# Altium schematic sheet FPGAPower&Misc.SchDoc: =ProjectName
size 420 x 297 mm; Author: G.K.; CompanyName: WUT; DrawnBy: P.K.; Organization: WUT ISE; Address1: Warsaw Univeristy of Technology; Address2: Nowowiejska 15/19; DocumentNumber: 5; Revision: 1.1; SheetNumber: 5; SheetTotal: 12; EDA_Number: ARTIQ; Projet: ARTIQ/SINARA; ModifiedBy: -; CreateDate: XX/XX/XXXX; CheckedDate: -; Title2: FPGAPower&Misc.SchDoc; DivGrp: ISE; Designer: G.K. and P.K.; ModifiedDate: -; ProjectName: ARTIQ/SINARA
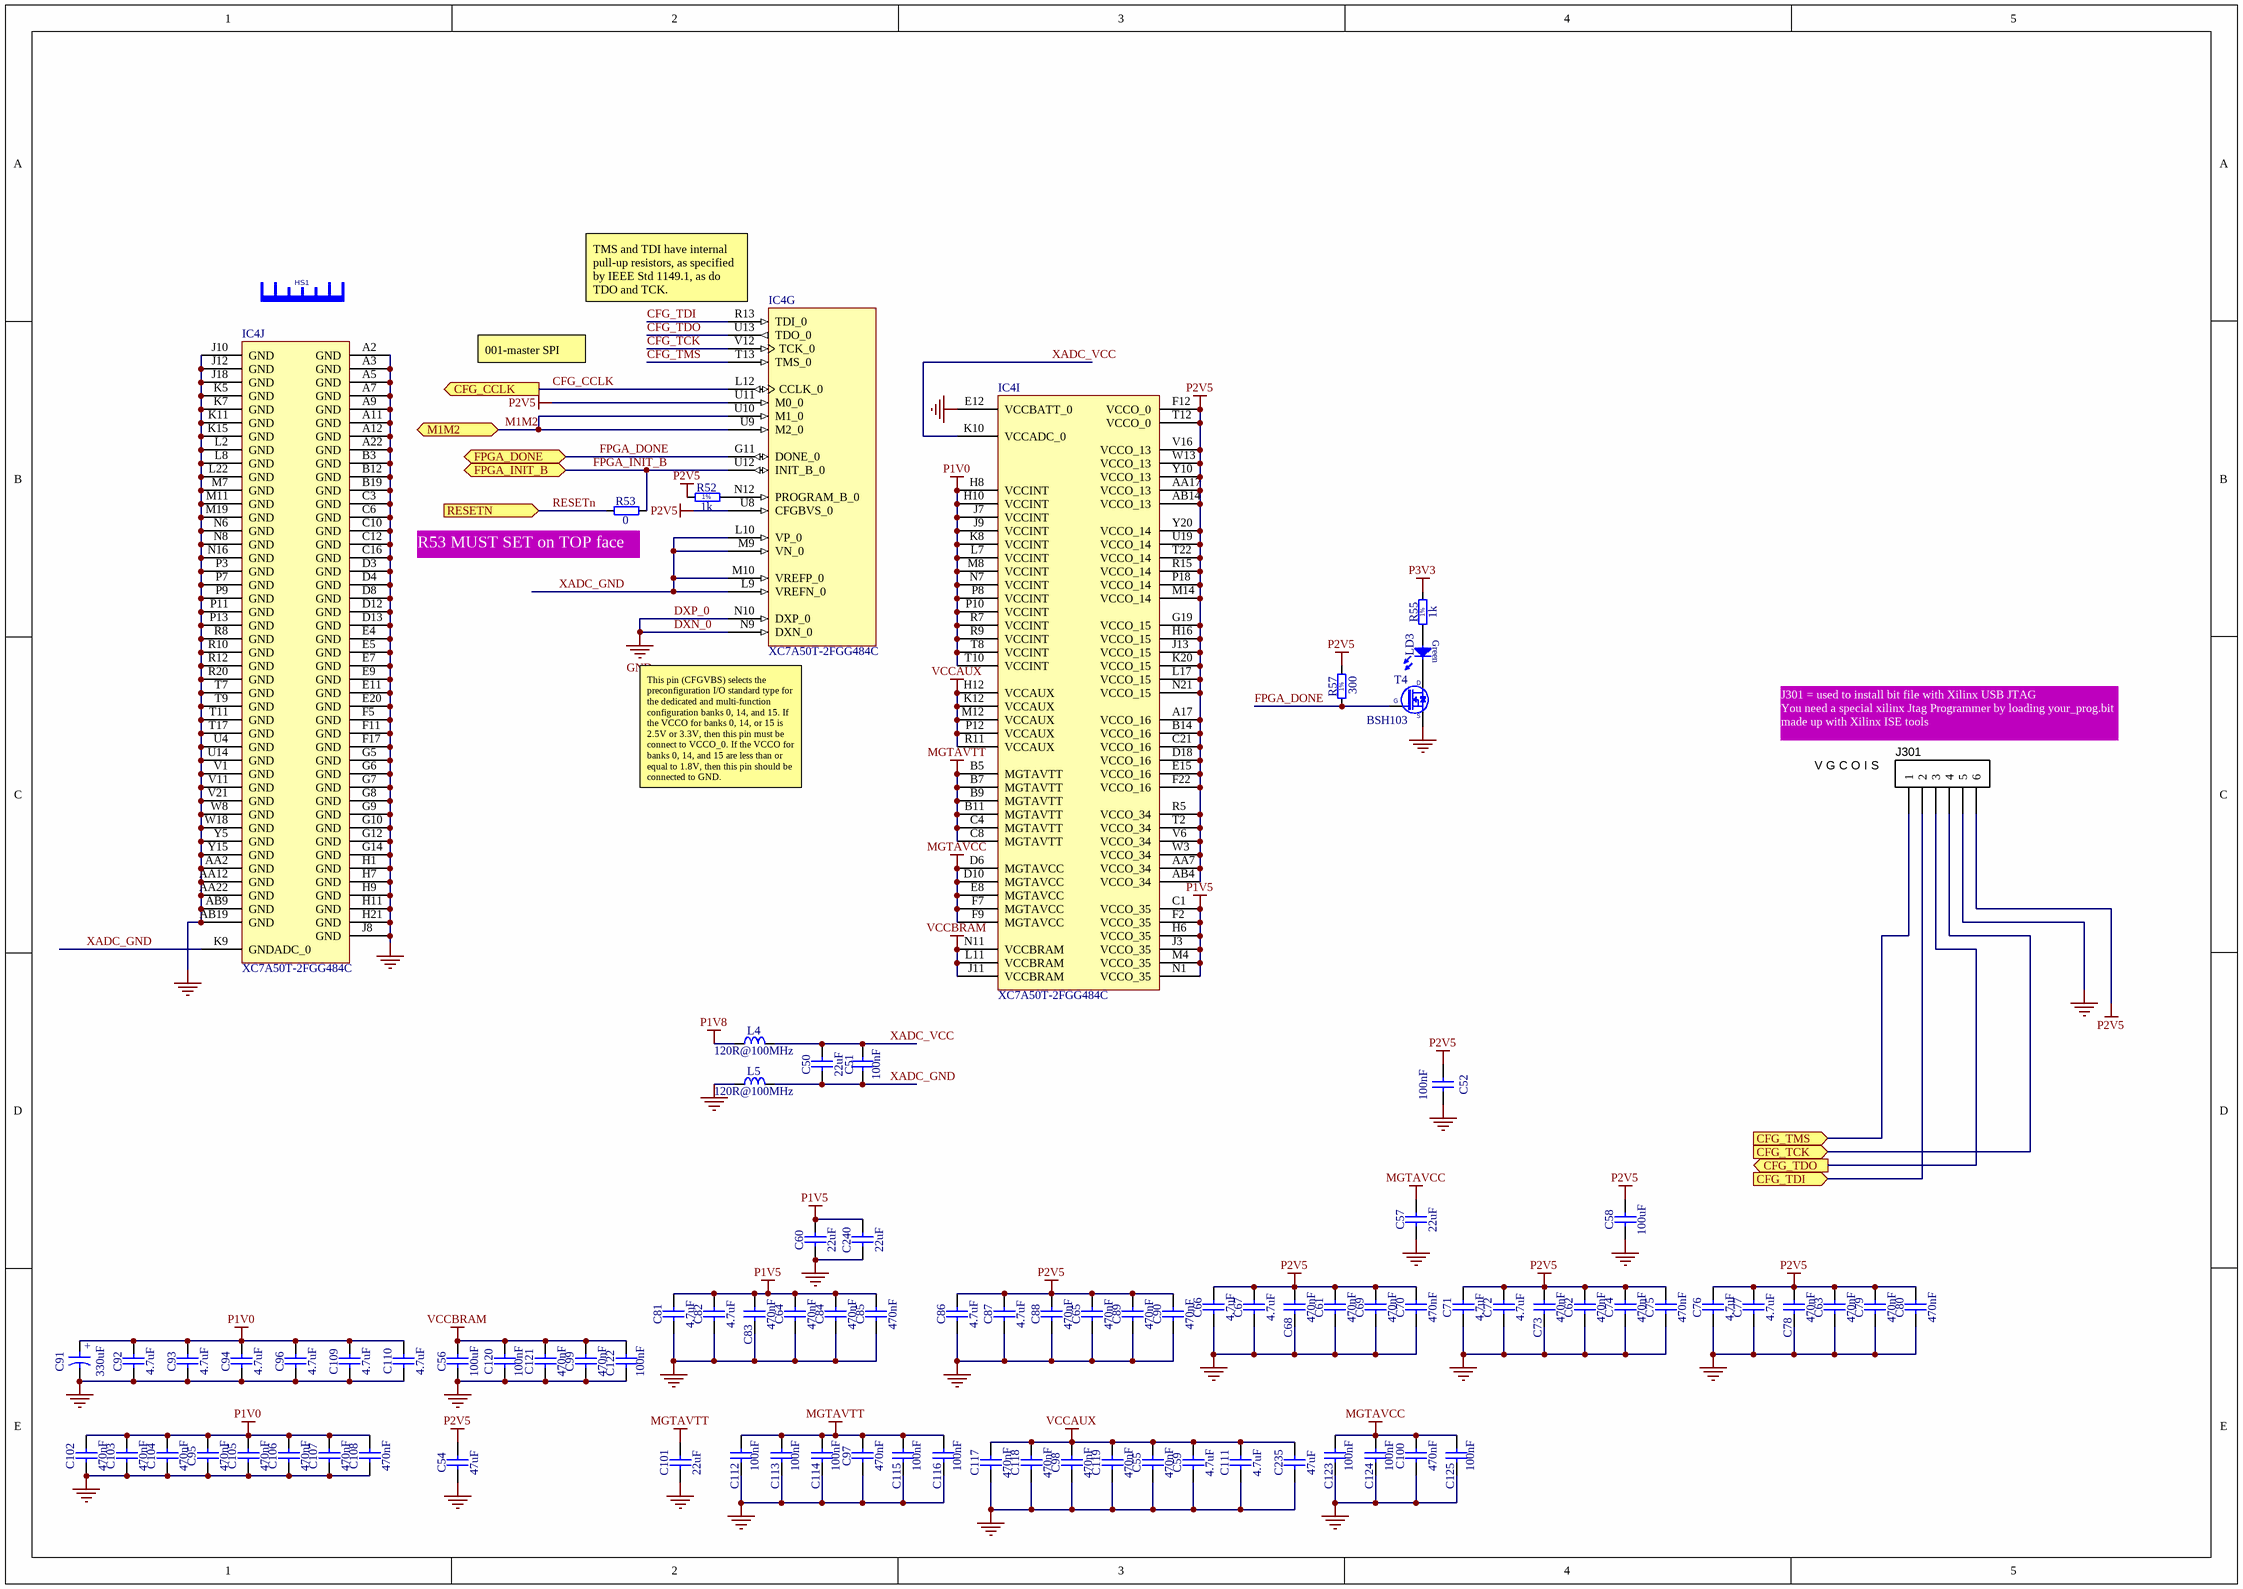
[diagram p0: FPGAPower&Misc.SchDoc]

## Parts
C50  22uF  [CAPC1709X100N]
C51  100nF  [CAPC0603X33N]
C52  100nF  [0603 Polar Cap]
C54  47uF  [CAPC3225X270N]
C55  470nF  [CAPC0603X33N]
C56  100uF  [CAPC3225X270N]
C57  22uF  [CAPC1709X100N]
C58  100uF  [CAPC3225X270N]
C59  4.7uF  [CAPC2012X135N]
C60  22uF  [CAPC1709X100N]
C61  470nF  [CAPC0603X33N]
C62  470nF  [CAPC0603X33N]
C63  470nF  [CAPC0603X33N]
C64  470nF  [CAPC0603X33N]
C65  470nF  [CAPC0603X33N]
C66  4.7uF  [CAPC2012X135N]
C67  4.7uF  [CAPC2012X135N]
C68  470nF  [CAPC0603X33N]
C69  470nF  [CAPC0603X33N]
C70  470nF  [CAPC0603X33N]
C71  4.7uF  [CAPC2012X135N]
C72  4.7uF  [CAPC2012X135N]
C73  470nF  [CAPC0603X33N]
C74  470nF  [CAPC0603X33N]
C75  470nF  [CAPC0603X33N]
C76  4.7uF  [CAPC2012X135N]
C77  4.7uF  [CAPC2012X135N]
C78  470nF  [CAPC0603X33N]
C79  470nF  [CAPC0603X33N]
C80  470nF  [CAPC0603X33N]
C81  4.7uF  [CAPC2012X135N]
C82  4.7uF  [CAPC2012X135N]
C83  470nF  [CAPC0603X33N]
C84  470nF  [CAPC0603X33N]
C85  470nF  [CAPC0603X33N]
C86  4.7uF  [CAPC2012X135N]
C87  4.7uF  [CAPC2012X135N]
C88  470nF  [CAPC0603X33N]
C89  470nF  [CAPC0603X33N]
C90  470nF  [CAPC0603X33N]
C91  330uF  [CAPMP7343X190N]
C92  4.7uF  [CAPC2012X135N]
C93  4.7uF  [CAPC2012X135N]
C94  4.7uF  [CAPC2012X135N]
C95  470nF  [CAPC0603X33N]
C96  4.7uF  [CAPC2012X135N]
C97  470nF  [CAPC0603X33N]
C98  470nF  [CAPC0603X33N]
C99  470nF  [CAPC0603X33N]
C100  470nF  [CAPC0603X33N]
C101  22uF  [CAPC1709X100N]
C102  470nF  [CAPC0603X33N]
C103  470nF  [CAPC0603X33N]
C104  470nF  [CAPC0603X33N]
C105  470nF  [CAPC0603X33N]
C106  470nF  [CAPC0603X33N]
C107  470nF  [CAPC0603X33N]
C108  470nF  [CAPC0603X33N]
C109  4.7uF  [CAPC2012X135N]
C110  4.7uF  [CAPC2012X135N]
C111  4.7uF  [CAPC2012X135N]
C112  100nF  [CAPC0603X33N]
C113  100nF  [CAPC0603X33N]
C114  100nF  [CAPC0603X33N]
C115  100nF  [CAPC0603X33N]
C116  100nF  [CAPC0603X33N]
C117  470nF  [CAPC0603X33N]
C118  470nF  [CAPC0603X33N]
C119  470nF  [CAPC0603X33N]
C120  100nF  [CAPC0603X33N]
C121  470nF  [CAPC0603X33N]
C122  100nF  [CAPC0603X33N]
C123  100nF  [CAPC0603X33N]
C124  100nF  [CAPC0603X33N]
C125  100nF  [CAPC0603X33N]
C235  47uF  [CAPC3225X270N]
C240  22uF  [CAPC1709X100N]
HS1  Heat Sink No Pad  [ICK BGA 23 x 23 x 10]  (value not drawn)
IC4  XC7A50T-2FGG484C  [FGG484]  (parts G,I,J of 10)
J301  V G C O I S  [HDR1X6]  (no BOM)
L4  120R@100MHz  [INDC1608X65N]
L5  120R@100MHz  [INDC1608X65N]
LD3  (no value)  [LED-0603-GREEN]
R52  1k  [RESC1005X40N]
R53  0  [RESC1005X40N]
R55  1k  [RESC1005X40N]
R57  300  [RESC1005X40N]
T4  BSH103  [SOT95P230X110-3N]

## Ports
CFG_CCLK (out), CFG_TCK (in), CFG_TDI (in), CFG_TDO (out), CFG_TMS (in), FPGA_DONE, FPGA_INIT_B, M1M2, RESETN (in)

## Nets
DXN_0: C52.1 C54.1 C55.1 C56.1 C57.1 C58.1 C59.1 C60.1 C61.1 C62.1 C63.1 C64.1 C65.1 C66.1 C67.1 C68.1 C69.1 C70.1 C71.1 C72.1 C73.1 C74.1 C75.1 C76.1 C77.1 C78.1 C79.1 C80.1 C81.1 C82.1 C83.1 C84.1 C85.1 C86.1 C87.1 C88.1 C89.1 C90.1 C91.2 C92.1 C93.1 C94.1 C95.1 C96.1 C97.1 C98.1 C99.1 C100.1 C101.1 C102.1 C103.1 C104.1 C105.1 C106.1 C107.1 C108.1 C109.1 C110.1 C111.1 C112.1 C113.1 C114.1 C115.1 C116.1 C117.1 C118.1 C119.1 C120.1 C121.1 C122.1 C123.1 C124.1 C125.1 C235.1 C240.1 IC4.A2(GND) IC4.A3(GND) IC4.A5(GND) IC4.A7(GND) IC4.A9(GND) IC4.A11(GND) IC4.A12(GND) IC4.A22(GND) IC4.AA2(GND) IC4.AA12(GND) IC4.AA22(GND) IC4.AB9(GND) IC4.AB19(GND) IC4.B3(GND) IC4.B12(GND) IC4.B19(GND) IC4.C3(GND) IC4.C6(GND) IC4.C10(GND) IC4.C12(GND) IC4.C16(GND) IC4.D3(GND) IC4.D4(GND) IC4.D8(GND) IC4.D12(GND) IC4.D13(GND) IC4.E4(GND) IC4.E5(GND) IC4.E7(GND) IC4.E9(GND) IC4.E11(GND) IC4.E12(VCCBATT_0) IC4.E20(GND) IC4.F5(GND) IC4.F11(GND) IC4.F17(GND) IC4.G5(GND) IC4.G6(GND) IC4.G7(GND) IC4.G8(GND) IC4.G9(GND) IC4.G10(GND) IC4.G12(GND) IC4.G14(GND) IC4.H1(GND) IC4.H7(GND) IC4.H9(GND) IC4.H11(GND) IC4.H21(GND) IC4.J8(GND) IC4.J10(GND) IC4.J12(GND) IC4.J18(GND) IC4.K5(GND) IC4.K7(GND) IC4.K11(GND) IC4.K15(GND) IC4.L2(GND) IC4.L8(GND) IC4.L22(GND) IC4.M7(GND) IC4.M11(GND) IC4.M19(GND) IC4.N6(GND) IC4.N8(GND) IC4.N9(DXN_0) IC4.N10(DXP_0) IC4.N16(GND) IC4.P3(GND) IC4.P7(GND) IC4.P9(GND) IC4.P11(GND) IC4.P13(GND) IC4.R8(GND) IC4.R10(GND) IC4.R12(GND) IC4.R20(GND) IC4.T7(GND) IC4.T9(GND) IC4.T11(GND) IC4.T17(GND) IC4.U4(GND) IC4.U14(GND) IC4.V1(GND) IC4.V11(GND) IC4.V21(GND) IC4.W8(GND) IC4.W18(GND) IC4.Y5(GND) IC4.Y15(GND) J301.5 L5.1 T4.2(S)  [also labelled DXP_0, GND]
MGTAVCC: C57.2 C100.2 C123.2 C124.2 C125.2 IC4.D6(MGTAVCC) IC4.D10(MGTAVCC) IC4.E8(MGTAVCC) IC4.F7(MGTAVCC) IC4.F9(MGTAVCC)
MGTAVTT: C97.2 C101.2 C112.2 C113.2 C114.2 C115.2 C116.2 IC4.B5(MGTAVTT) IC4.B7(MGTAVTT) IC4.B9(MGTAVTT) IC4.B11(MGTAVTT) IC4.C4(MGTAVTT) IC4.C8(MGTAVTT)
P1V0: C91.1 C92.2 C93.2 C94.2 C95.2 C96.2 C102.2 C103.2 C104.2 C105.2 C106.2 C107.2 C108.2 C109.2 C110.2 IC4.H8(VCCINT) IC4.H10(VCCINT) IC4.J7(VCCINT) IC4.J9(VCCINT) IC4.K8(VCCINT) IC4.L7(VCCINT) IC4.M8(VCCINT) IC4.N7(VCCINT) IC4.P8(VCCINT) IC4.P10(VCCINT) IC4.R7(VCCINT) IC4.R9(VCCINT) IC4.T8(VCCINT) IC4.T10(VCCINT)
P1V5: C60.2 C64.2 C81.2 C82.2 C83.2 C84.2 C85.2 C240.2 IC4.C1(VCCO_35) IC4.F2(VCCO_35) IC4.H6(VCCO_35) IC4.J3(VCCO_35) IC4.M4(VCCO_35) IC4.N1(VCCO_35)
P1V8: L4.1
P2V5: C52.2 C54.2 C58.2 C61.2 C62.2 C63.2 C65.2 C66.2 C67.2 C68.2 C69.2 C70.2 C71.2 C72.2 C73.2 C74.2 C75.2 C76.2 C77.2 C78.2 C79.2 C80.2 C86.2 C87.2 C88.2 C89.2 C90.2 IC4.A17(VCCO_16) IC4.AA7(VCCO_34) IC4.AA17(VCCO_13) IC4.AB4(VCCO_34) IC4.AB14(VCCO_13) IC4.B14(VCCO_16) IC4.C21(VCCO_16) IC4.D18(VCCO_16) IC4.E15(VCCO_16) IC4.F12(VCCO_0) IC4.F22(VCCO_16) IC4.G19(VCCO_15) IC4.H16(VCCO_15) IC4.J13(VCCO_15) IC4.K20(VCCO_15) IC4.L17(VCCO_15) IC4.M14(VCCO_14) IC4.N21(VCCO_15) IC4.P18(VCCO_14) IC4.R5(VCCO_34) IC4.R15(VCCO_14) IC4.T2(VCCO_34) IC4.T12(VCCO_0) IC4.T22(VCCO_14) IC4.U8(CFGBVS_0) IC4.U11(M0_0) IC4.U19(VCCO_14) IC4.V6(VCCO_34) IC4.V16(VCCO_13) IC4.W3(VCCO_34) IC4.W13(VCCO_13) IC4.Y10(VCCO_13) IC4.Y20(VCCO_14) J301.6 R52.1 R57.2
P3V3: R55.2
VCCAUX: C55.2 C59.2 C98.2 C111.2 C117.2 C118.2 C119.2 C235.2 IC4.H12(VCCAUX) IC4.K12(VCCAUX) IC4.M12(VCCAUX) IC4.P12(VCCAUX) IC4.R11(VCCAUX)
VCCBRAM: C56.2 C99.2 C120.2 C121.2 C122.2 IC4.J11(VCCBRAM) IC4.L11(VCCBRAM) IC4.N11(VCCBRAM)
CFG_CCLK: IC4.L12(CCLK_0) ; port CFG_CCLK
CFG_TCK: IC4.V12(TCK_0)
CFG_TCK: J301.4 ; port CFG_TCK  [a separate net that carries the same name]
CFG_TDI: IC4.R13(TDI_0)
CFG_TDI: J301.2 ; port CFG_TDI  [a separate net that carries the same name]
CFG_TDO: IC4.U13(TDO_0)
CFG_TDO: J301.3 ; port CFG_TDO  [a separate net that carries the same name]
CFG_TMS: IC4.T13(TMS_0)
CFG_TMS: J301.1 ; port CFG_TMS  [a separate net that carries the same name]
FPGA_DONE: IC4.G11(DONE_0) R57.1 T4.1(G) ; port FPGA_DONE
FPGA_INIT_B: IC4.U12(INIT_B_0) R53.2 ; port FPGA_INIT_B
M1M2: IC4.U9(M2_0) IC4.U10(M1_0) ; port M1M2
RESETn: R53.1 ; port RESETN
XADC_GND: C50.1 C51.1 IC4.K9(GNDADC_0) IC4.L9(VREFN_0) IC4.L10(VP_0) IC4.M9(VN_0) IC4.M10(VREFP_0) L5.2
XADC_VCC: C50.2 C51.2 IC4.K10(VCCADC_0) L4.2
NetIC4_N12: IC4.N12(PROGRAM_B_0) R52.2
NetLD3_1: LD3.1(A) R55.1
NetLD3_2: LD3.2(C) T4.3(D)

## Notes on the sheet
- (near IC4) TMS and TDI have internal pull-up resistors, as specified by IEEE Std 1149.1, as do TDO and TCK.
- 001-master SPI
- (near R53) R53 MUST SET on TOP face
- (near IC4) This pin (CFGVBS) selects the preconfiguration I/O standard type for the dedicated and multi-function configuration banks 0, 14, and 15. If the VCCO for banks 0, 14, or 15 is 2.5V or 3.3V, then this pin must be connect to VCCO_0. If the VCCO for banks 0, 14, and 15 are less than or equal to 1.8V, then this pin should be connected to GND.
- (near J301) J301 = used to install bit file with Xilinx USB JTAG
  You need a special xilinx Jtag Programmer by loading your_prog.bit
  made up with Xilinx ISE tools
- (in symbol CTE7343-19_330UF_2.5V_20%_LESR0025_KEMET_T520) +
- (in symbol KINGBRIGHT_KPTR-3216CGCK) Green
- (in symbol R0402_1K_1%_0.0625W_100PPM) 1%
- (in symbol R0402_1k_1%_0.0625W_100PPM) 1%
- (in symbol R0402_300R_1%_0.0625W_100PPM) 1%

## Library data of the parts
C50 C57 C60 C101 C240 = CC0603_22UF_6.3V_20%_X5R: Non-polarised capacitor; Part Description: SMD Multilayer Chip Ceramic Capacitor; Manufacturer: GENERIC; Manufacturer1 Part Number: C1608X5R0J226M080AC; Voltage: 6.3V; TC: X5R; Tolerance: ±20%; Part Number: CC0603_22UF_6.3V_20%_X5R; Component Kind: Standard; Component Type: Standard; Pin Count: 2; Value: 22uF; Status: None; Manufacturer Part Number: CC0603_22UF_6.3V_20%_X5R; Case: 0603; Mounted: Yes; Socket: No; SMD: Yes; Sense: No; Manufacturer1 Example: TDK; Manufacturer1 ComponentHeight: 1mm; HelpURL: \\cern.ch\dfs\Applications\Altium\Datasheets\CC0603_X5R_TDK_C.pdf; Author: CERN DEM JLC; CreateDate: 16.12.2013; LatestRevisionDate: 13.09.2016; ClassName: Artix
C51 C52 C112-C116 C120 C122-C125 = CC0201_100NF_6.3V_10%_X5R: Non-polarised capacitor; Part Description: SMD Multilayer Chip Ceramic Capacitor; Manufacturer: GENERIC; Manufacturer1 Part Number: 02016D104KAT2A; Voltage: 6.3V; TC: X5R; Tolerance: ±10%; Part Number: CC0201_100NF_6.3V_10%_X5R; Component Kind: Standard; Component Type: Standard; Pin Count: 2; Value: 100nF; Status: Not Recommended; Manufacturer Part Number: CC0201_100NF_6.3V_10%_X5R; Case: 0201; Mounted: Yes; Socket: No; SMD: Yes; Sense: No; Manufacturer1 Example: AVX; Manufacturer1 ComponentHeight: 0.33mm; HelpURL: \\cern.ch\dfs\Applications\Altium\Datasheets\CC0201_X5R_AVX.pdf; Author: CERN DEM JLC; CreateDate: 2007-12-03; LatestRevisionDate: 2007-12-03
  C51 C112-C116 C120 C122-C125: ClassName: Artix
  C52: Footprint: CAPC0603X33N; ClassName: FPGA_JTAG
C54 C235 = CC1210_47UF_10V_10%_X7R: Non-polarised capacitor; Part Description: SMD Multilayer Chip Ceramic Capacitor; Manufacturer: GENERIC; Manufacturer1 Part Number: GRM32ER71A476KE15; Voltage: 10V; TC: X7R; Tolerance: ±10%; Part Number: CC1210_47UF_10V_10%_X7R; Component Kind: Standard; Component Type: Standard; Pin Count: 2; Value: 47uF; Status: None; Manufacturer Part Number: CC1210_47UF_10V_10%_X7R; Case: 1210; Mounted: Yes; Socket: No; SMD: Yes; Sense: No; Manufacturer1 Example: MURATA; Manufacturer1 ComponentHeight: 2.7mm; HelpURL: \\cern.ch\dfs\Applications\Altium\Datasheets\CC1210_X7R_MURATA.pdf; Author: CERN DEM BC; CreateDate: 18.11.2015; LatestRevisionDate: 18.11.2015
C55 C61-C65 C68-C70 C73-C75 C78-C80 C83-C85 C88-C90 C95 C97-C100 C102-C108 C117-C119 C121 = CC0201_470NF_4V_20%_X5R: Non-polarised capacitor; Part Description: SMD Multilayer Chip Ceramic Capacitor; Manufacturer: GENERIC; Manufacturer1 Part Number: AMK063BJ474MP-F; Voltage: 4V; TC: X5R; Tolerance: ±20%; Part Number: CC0201_470NF_4V_20%_X5R; Component Kind: Standard; Component Type: Standard; Pin Count: 2; Value: 470nF; Status: Not Recommended; Manufacturer Part Number: CC0201_470NF_4V_20%_X5R; Case: 0201; Mounted: Yes; Socket: No; SMD: Yes; Sense: No; Manufacturer1 Example: TAIYO YUDEN; Manufacturer1 ComponentHeight: 0.33mm; HelpURL: \\cern.ch\dfs\Applications\Altium\Datasheets\CC0201_X5R_TAIYO-YUDEN_STANDARD-CLASS2.pdf; Author: CERN DEM JLC; CreateDate: 27.05.2010; LatestRevisionDate: 27.05.2010
  C61-C65 C95 C97-C100: ClassName: Artix
C56 C58 = CC1210_100UF_6.3V_20%_X5R: Non-polarised capacitor; Part Description: SMD Multilayer Chip Ceramic Capacitor; Manufacturer: GENERIC; Manufacturer1 Part Number: GRM32ER60J107ME20L; Voltage: 6.3V; TC: X5R; Tolerance: ±20%; Part Number: CC1210_100UF_6.3V_20%_X5R; Component Kind: Standard; Component Type: Standard; Pin Count: 2; Value: 100uF; Status: Preferred; Manufacturer Part Number: CC1210_100UF_6.3V_20%_X5R; Case: 1210; Mounted: Yes; Socket: No; SMD: Yes; Sense: No; Manufacturer1 Example: MURATA; Manufacturer1 ComponentHeight: 2.7mm; HelpURL: \\cern.ch\dfs\Applications\Altium\Datasheets\CC1210_X5R_MURATA.pdf; Author: CERN DEM JLC; CreateDate: 19.04.2010; LatestRevisionDate: 19.04.2010
C59 C66 C67 C71 C72 C76 C77 C81 C82 C86 C87 C92-C94 C96 C109-C111 = CC0805_4.7UF_10V_10%_X5R: Non-polarised capacitor; Manufacturer: GENERIC; Part Description: SMD Multilayer Chip Ceramic Capacitor; Manufacturer1 Part Number: 222224013672; Voltage: 10V; TC: X5R; Tolerance: ±10%; Part Number: CC0805_4.7UF_10V_10%_X5R; Component Kind: Standard; Component Type: Standard; Pin Count: 2; Value: 4.7uF; Status: Preferred; Manufacturer Part Number: CC0805_4.7UF_10V_10%_X5R; Case: 0805; Mounted: Yes; Socket: No; SMD: Yes; Sense: No; Manufacturer1 Example: PHYCOMP; Manufacturer1 ComponentHeight: 1.45mm; HelpURL: \\cern.ch\dfs\Applications\Altium\Datasheets\CC0805_X5R_PHYCOMP_HC.pdf; Author: CERN DEM JLC; CreateDate: 03.12.2007; LatestRevisionDate: 03.12.2007
C91 = CTE7343-19_330UF_2.5V_20%_LESR0025_KEMET_T520: Polarised capacitor; Part Description: Low ESR 0R025 Tantalum Chip Capacitor; Manufacturer: KEMET; Manufacturer Part Number: T520V337M2R5ATE025; Voltage: 2.5V; Tolerance: ±20%; Part Number: CTE7343-19_330UF_2.5V_20%_LESR0025_KEMET_T520; Component Kind: Standard; Component Type: Standard; Pin Count: 2; Value: 330uF; Status: None; Case: V; Mounted: Yes; Socket: No; SMD: Yes; Sense: No; ComponentHeight: 1.9mm; HelpURL: \\cern.ch\dfs\Applications\Altium\Datasheets\CTE-LESR_KEMET_T520.pdf; Author: CERN DEM MR; CreateDate: 23.03.2016; LatestRevisionDate: 23.03.2016
HS1 = Heat Sink No Pad: Heat Sink Without Pad; Manufacturer: Fischer Elektronik; Part Description: 23 x 23 x 10 mm, heatsink for IC design BGA and others; Manufacturer Part Number: ICK BGA 23 x 23 x 10; ComponentHeight: 10 mm; HelpURL: http://www.fischerelektronik.de/web_fischer/en_GB/heatsinks/B02/Heatsinks%20for%20BGAs/PR/ICKBGA23x23x10_/$productCard/parameters/datasheet.xhtml
IC4 = CMP-0364-00026-3: Artix-7 FPGA, 285 User I/Os, 4 GTP, 484-Ball BGA, Speed Grade 2, Commercial Grade, Pb-Free; Generic Part Number: XC7A100T; Manufacturer: Xilinx; Max User I/O: 300; Clock Mgmt Tiles (CMTs): 6; Logic Cells: 101440; Block RAM Blocks (36Kb): 135; Block RAM Blocks (18Kb): 270; Speed Grade: -2; CLBs (Slices): 15850; Block RAM Blocks (Max Kb): 4860; DSP48E1 Slices: 240; RoHS: Pb-Free; ComponentLink3URL: http://www.xilinx.com/support/documentation/data_sheets/ds181_Artix_7_Data_Sheet.pdf; NexusDeviceID: XC7A100T-2FGG484C; DatasheetVersion: v1.12; Mounting Technology: Surface Mount; PackageDescription: Wire-Bond Fine-Pitch BGA, Body 23 x 23 mm, 1.0 mm Pitch; PackageReference: FGG484; ComponentLink2Description: Package Specification; Code_JEDEC: MS-034-AAJ-1; ComponentLink2URL: http://www.xilinx.com/support/documentation/user_guides/ug475_7Series_Pkg_Pinout.pdf; ComponentLink3Description: DC and Switching Characteristics; ComponentLink4Description: Package File; ComponentLink4URL: http://www.xilinx.com/support/packagefiles/a7packages/xc7a100tfgg484pkg.txt; ComponentLink1URL: http://www.xilinx.com/support/documentation/data_sheets/ds180_7Series_Overview.pdf; PartNumber: XC7A100T-2FGG484C; ComponentLink5URL: http://www.xilinx.com/support/documentation/user_guides/ug475_7Series_Pkg_Pinout.pdf; PackageVersion: Rev 1.8; ComponentLink5Description: Packaging and Pinout; ComponentLink1Description: Datasheet; CLBs (Max Distributed RAM Kb): 1188; ClassName: Artix
J301 = Header6P: Header, 6-pin, FPGA_JTAG
L4 L5 = IND0603_MURATA_BLM18SG121TN1D: Inductor; Part Description: SMD EMIFIL Suppression Chip Ferrite Bead; Manufacturer: MURATA; Power: 3A; Resistance: 0.025R; Tolerance: ±25%; Part Number: IND0603_MURATA_BLM18SG121TN1D; Component Kind: Standard; Component Type: Standard; Pin Count: 2; Value: 120R@100MHz; Status: None; Manufacturer Part Number: BLM18SG121TN1D; Case: 0603; Mounted: Yes; Socket: No; SMD: Yes; Sense: No; ComponentHeight: 0.65mm; HelpURL: \\cern.ch\dfs\Applications\Altium\Datasheets\IND0603_MURATA_BLM18S.pdf; Author: CERN DEM JLC; CreateDate: 23.07.2014; LatestRevisionDate: 23.07.2014; ClassName: Artix
LD3 = KINGBRIGHT_KPTR-3216CGCK: LED Green 1A 2C; Manufacturer Part Number: KPH-1608CGCK; ComponentHeight: 0.65mm; HelpURL: http://datasheet.octopart.com/KPH-1608CGCK-Kingbright-datasheet-62316526.pdf; Package Description: SMT Green LED, Case 0603, Body L 1.6 x W 0.8mm H 0.65mm
R52 = R0402_1K_1%_0.0625W_100PPM: Resistor - 1%; Part Description: General Purpose Thick Film Chip Resistor; Manufacturer: GENERIC; Manufacturer1 Part Number: 232270671002L; TC: ±100ppm/°C; PressFit: No; Part Number: R0402_1K_1%_0.0625W_100PPM; Component Kind: Standard; Component Type: Standard; Pin Count: 2; Value: 1k; Status: Not Recommended; Power: 0.0625W; Tolerance: ±1%; Manufacturer Part Number: R0402_1K_1%_0.0625W_100PPM; Case: 0402; Mounted: Yes; Sense: No; Socket: No; SMD: Yes; Manufacturer1 Example: YAGEO PHYCOMP; Manufacturer1 ComponentHeight: 0.4mm; HelpURL: \\cern.ch\dfs\Applications\Altium\Datasheets\R0402_Phycomp_RC0402.pdf; Author: CERN DEM JLC; CreateDate: 03.12.2007; LatestRevisionDate: 17.10.2012; ClassName: Artix
R53 = R0402_0R_JUMPER: Resistor; Part Description: 1A (0.05R Max DC Resistance) Zero Ohm Jumper; Manufacturer: GENERIC; Manufacturer1 Part Number: 232270591001L; PressFit: No; Part Number: R0402_0R_JUMPER; Component Kind: Standard; Component Type: Standard; Pin Count: 2; Value: 0; Status: Not Recommended; Manufacturer Part Number: R0402_0R_JUMPER; Case: 0402; Mounted: Yes; Sense: No; Socket: No; SMD: Yes; Manufacturer1 Example: YAGEO PHYCOMP; Manufacturer1 ComponentHeight: 0.4mm; HelpURL: \\cern.ch\dfs\Applications\Altium\Datasheets\R0402_Phycomp_RC0402.pdf; Author: CERN DEM JLC; CreateDate: 03.12.2007; LatestRevisionDate: 17.10.2012; ClassName: Artix
R55 = R0402_1k_1%_0.0625W_100PPM: Resistor - 1%; Part Description: General Purpose Thick Film Chip Resistor; Manufacturer: GENERIC; Manufacturer1 Part Number: 232270671002L; TC: ±100ppm/°C; PressFit: No; Part Number: R0402_1K_1%_0.0625W_100PPM; Component Kind: Standard; Component Type: Standard; Pin Count: 2; Value: 1k; Status: Not Recommended; Power: 0.0625W; Tolerance: ±1%; Manufacturer Part Number: R0402_1K_1%_0.0625W_100PPM; Case: 0402; Mounted: Yes; Sense: No; Socket: No; SMD: Yes; Manufacturer1 Example: YAGEO PHYCOMP; Manufacturer1 ComponentHeight: 0.4mm; HelpURL: \\cern.ch\dfs\Applications\Altium\Datasheets\R0402_Phycomp_RC0402.pdf; Author: CERN DEM JLC; CreateDate: 03.12.2007; LatestRevisionDate: 17.10.2012; ClassName: Artix
R57 = R0402_300R_1%_0.0625W_100PPM: Resistor - 1%; Part Description: General Purpose Thick Film Chip Resistor; Manufacturer: GENERIC; Manufacturer1 Part Number: 232270673001L; TC: ±100ppm/°C; PressFit: No; Part Number: R0402_300R_1%_0.0625W_100PPM; Component Kind: Standard; Component Type: Standard; Pin Count: 2; Value: 300; Status: Not Recommended; Power: 0.0625W; Tolerance: ±1%; Manufacturer Part Number: R0402_300R_1%_0.0625W_100PPM; Case: 0402; Mounted: Yes; Sense: No; Socket: No; SMD: Yes; Manufacturer1 Example: YAGEO PHYCOMP; Manufacturer1 ComponentHeight: 0.4mm; HelpURL: \\cern.ch\dfs\Applications\Altium\Datasheets\R0402_Phycomp_RC0402.pdf; Author: CERN DEM JLC; CreateDate: 03.12.2007; LatestRevisionDate: 17.10.2012
T4 = BSH103: N-CHANNEL MOSFET WITH DIODE; Part Description: 30V 850mA N-Channel Enhancement Mode Field-Effect Transistor; Manufacturer: NEXPERIA; PressFit: No; Bonding: No; Part Number: BSH103; Component Kind: Standard; Component Type: Standard; Device: BSH103; PackageDescription: SOT23, 3 pin, Pitch 0.95mm - 1.3mm W X 2.9mm L X 1.1mm H, IPC Medium Density; Manufacturer Part Number: BSH103; Pin Count: 3; Case: SOT23-3; Mounted: Yes; Socket: No; SMD: Yes; Sense: No; ComponentHeight: 1.1mm; HelpURL: \\cern.ch\dfs\Applications\Altium\Datasheets\BSH103.pdf; Author: CERN DEM JLC; CreateDate: 16.03.2010; LatestRevisionDate: 20.06.2017; ClassName: Artix